# Altium schematic sheet Microcontrolador.SchDoc
size A4
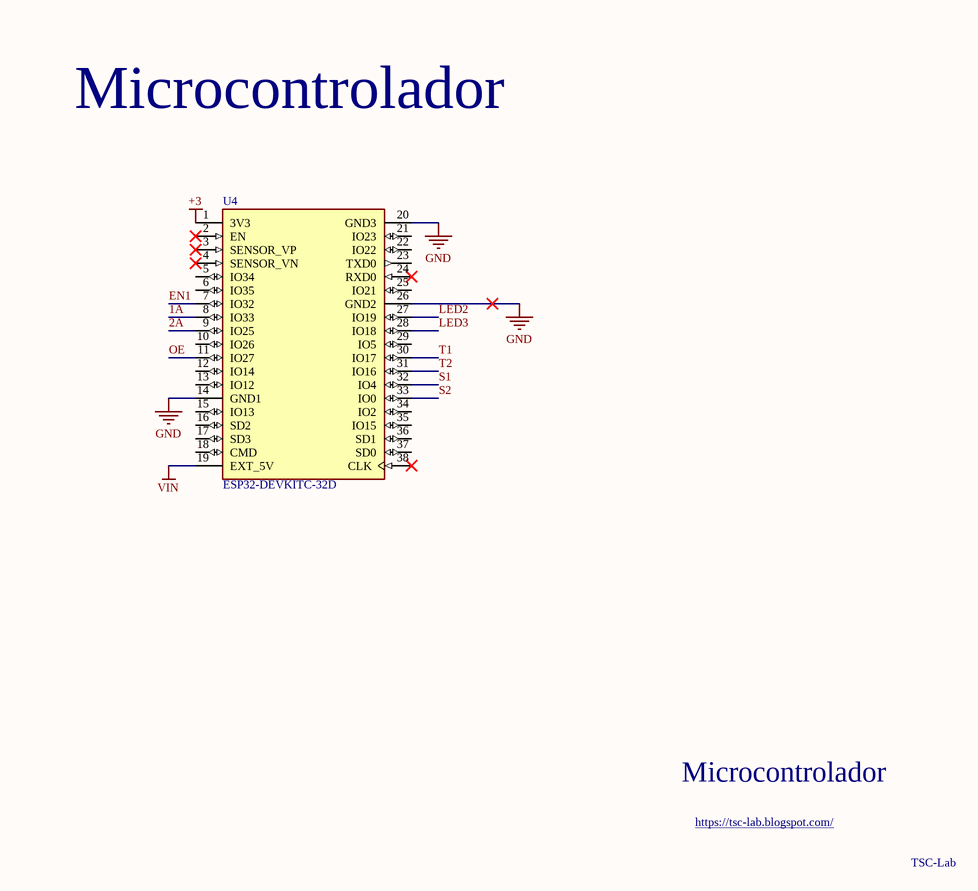
[diagram p0: Microcontrolador.SchDoc]

## Parts
U4  ESP32-DEVKITC-32D  [MODULE_ESP32-DEVKITC-32D]

## Nets
+3: U4.1(3V3)
GND: U4.14(GND1) U4.20(GND3) U4.26(GND2)
VIN: U4.19(EXT_5V)
1A: U4.8(IO33)
2A: U4.9(IO25)
EN1: U4.7(IO32)
LED2: U4.27(IO19)
LED3: U4.28(IO18)
OE: U4.11(IO27)
S1: U4.32(IO4)
S2: U4.33(IO0)
T1: U4.30(IO17)
T2: U4.31(IO16)

Not connected (* = marked no-connect by the designer): U4 2(EN)* 3(SENSOR_VP)* 4(SENSOR_VN)* 5(IO34) 6(IO35) 10(IO26) 12(IO14) 13(IO12) 15(IO13) 16(SD2) 17(SD3) 18(CMD) 21(IO23) 22(IO22) 23(TXD0) 24(RXD0)* 25(IO21) 29(IO5) 34(IO2) 35(IO15) 36(SD1) 37(SD0) 38(CLK)*

## Notes on the sheet
- Microcontrolador
- https://tsc-lab.blogspot.com/
- TSC-Lab

## Library data of the parts
U4 = ESP32-DEVKITC-32D: Eval Board For Esp-Wroom-32; MF: {'manufacturer': u'Espressif Systems'}; Availability: Unavailable; MP: ESP32-DEVKITC-32D; Price: None; Value: *; Package: None